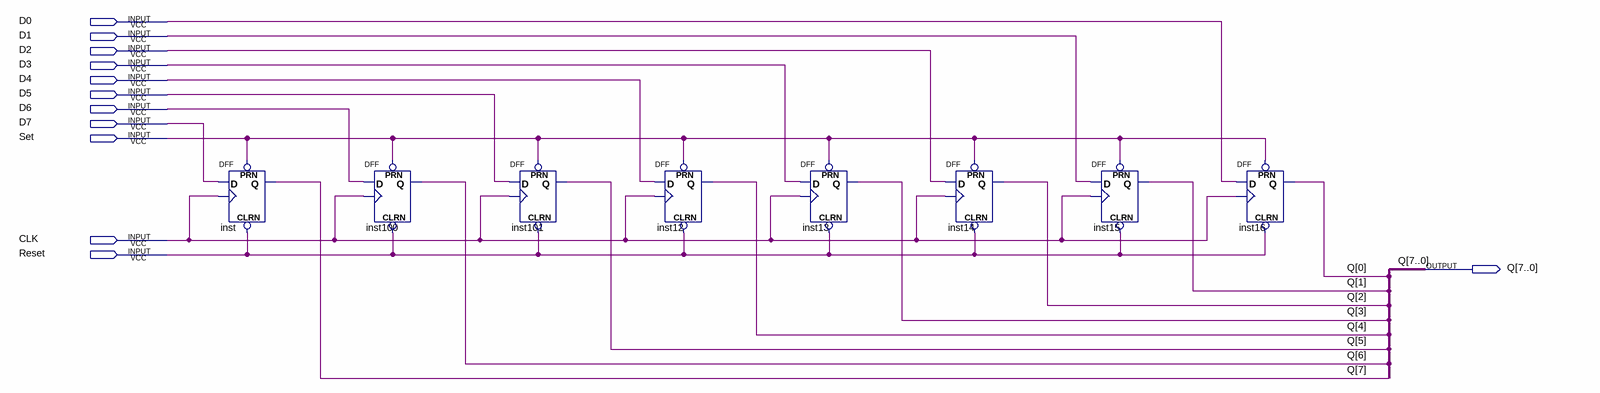
[diagram p0: schematic sheet]
// Quartus schematic D-FF.bdf as structural Verilog: 8 symbols, 12 pins
module \D-FF  (
  input  D0,
  input  D1,
  input  D2,
  input  D3,
  input  D4,
  input  D5,
  input  D6,
  input  D7,
  input  Set,
  input  CLK,
  input  Reset,
  output [7:0] Q
);

  DFF inst (.CLRN(Reset), .CLK(CLK), .D(D7), .PRN(Set), .Q(Q[7]));
  DFF inst100 (.CLRN(Reset), .CLK(CLK), .D(D6), .PRN(Set), .Q(Q[6]));
  DFF inst101 (.CLRN(Reset), .CLK(CLK), .D(D5), .PRN(Set), .Q(Q[5]));
  DFF inst12 (.CLRN(Reset), .CLK(CLK), .D(D4), .PRN(Set), .Q(Q[4]));
  DFF inst13 (.CLRN(Reset), .CLK(CLK), .D(D3), .PRN(Set), .Q(Q[3]));
  DFF inst14 (.CLRN(Reset), .CLK(CLK), .D(D2), .PRN(Set), .Q(Q[2]));
  DFF inst15 (.CLRN(Reset), .CLK(CLK), .D(D1), .PRN(Set), .Q(Q[1]));
  DFF inst16 (.CLRN(Reset), .CLK(CLK), .D(D0), .PRN(Set), .Q(Q[0]));
endmodule
